# EAGLE design RPi SPI Display Breakout Board (EAGLE 9.6.1)
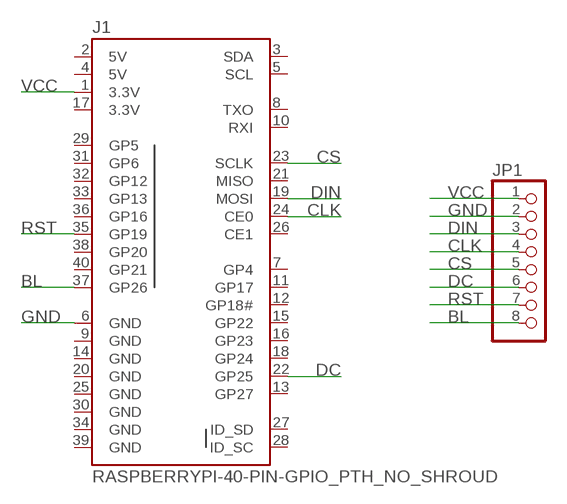
[diagram p0: schematic, sheet 1]

## Parts
J1  RASPBERRYPI-40-PIN-GPIO_PTH_NO_SHROUD  [2X20]
JP1  PINHD-1X8  [1X08]

## Nets
BL: J1.37(GP26) JP1.8
CLK: J1.24(CE0) JP1.4
CS: J1.23(SCLK) JP1.5
DC: J1.22(GP25) JP1.6
DIN: J1.19(MOSI) JP1.3
GND: J1.6(GND) JP1.2
RST: J1.35(GP19) JP1.7
VCC: J1.1(3.3V) JP1.1
Unconnected: J1.3(SDA) J1.5(SCL) J1.7(GP4) J1.8(TXO) J1.10(RXI) J1.11(GP17) J1.12(GP18#) J1.13(GP27) J1.15(GP22) J1.16(GP23) J1.18(GP24) J1.21(MISO) J1.26(CE1) J1.27(ID_SD) J1.28(ID_SC) J1.29(GP5) J1.31(GP6) J1.32(GP12) J1.33(GP13) J1.36(GP16) J1.38(GP20) J1.40(GP21)

## Power pins joined to a net without a drawn wire
3.3V: J1.17(3.3V)
5V: J1.2(5V) J1.4(5V)
GND: J1.9(GND) J1.14(GND) J1.20(GND) J1.25(GND) J1.30(GND) J1.34(GND) J1.39(GND)

## Library data of the parts
J1 = SparkFun-Connectors:RASPBERRYPI-40-PIN-GPIO: Raspberry Pi GPIO Header 2x20 pin connector, as found on B, B+, A+ models. Both shrouded PTH and SMT versions available. SparkFun Products: GPIO Shrouded Header <https://www.sparkfun.com/products/13054>- PTH SparkFun Pi Wedge (Preassembled) <https://www.sparkfun.com/products/13717>
JP1 = pinhead:PINHD-1X8: PIN HEADER

## Board
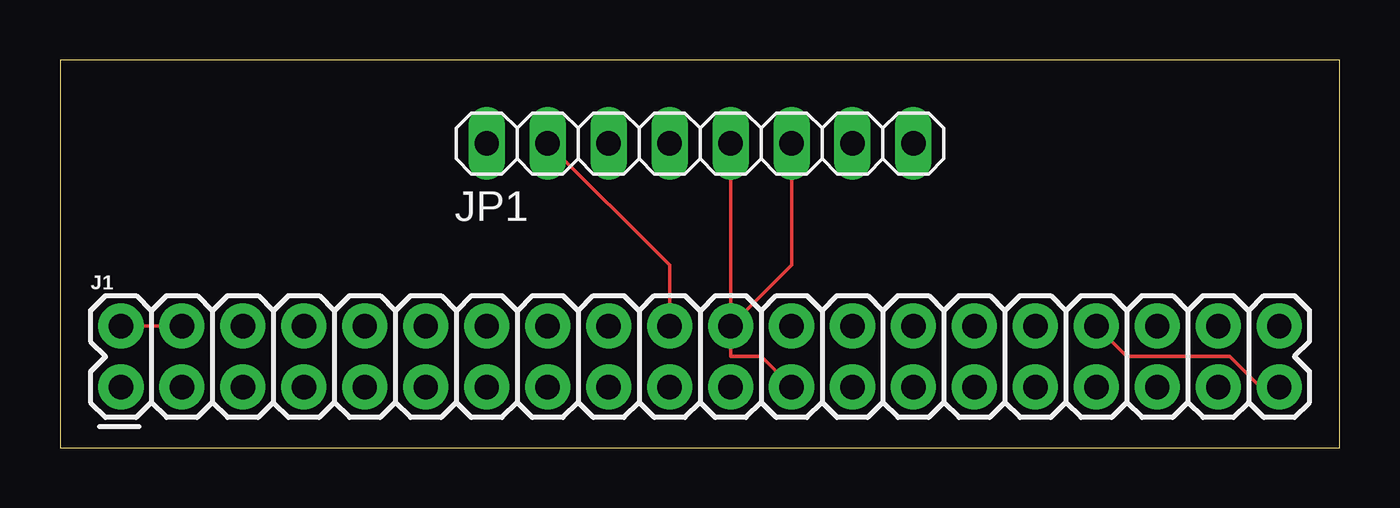
[diagram p1: board, top side]
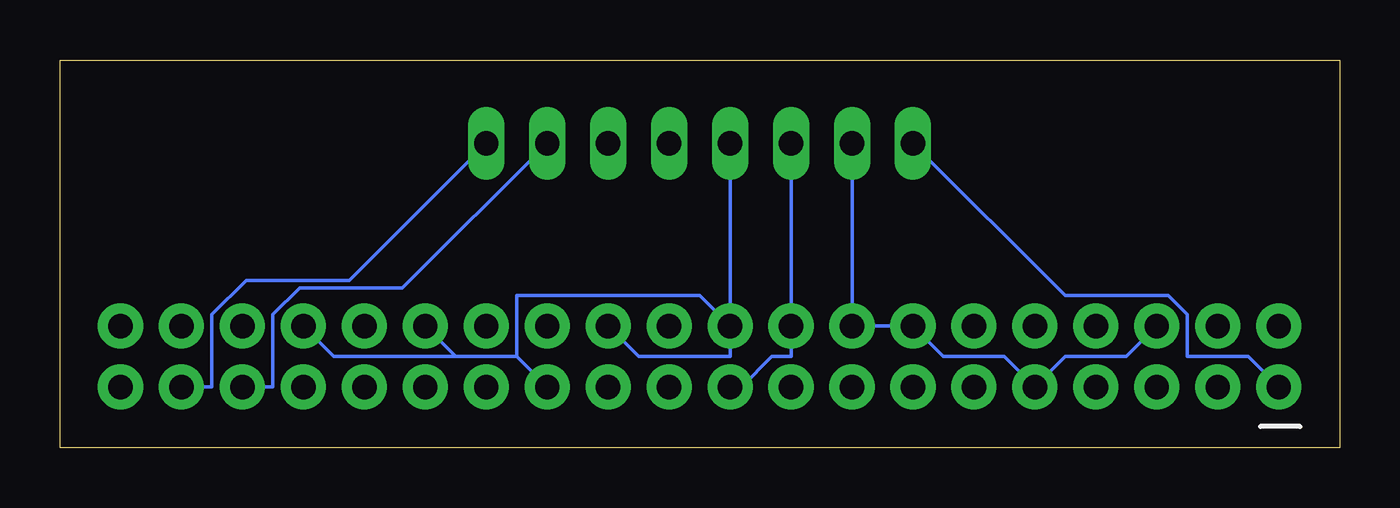
[diagram p2: board, bottom side, seen from below]

Size 53.32 x 16.18 mm. Coordinates in mm from the lower left corner, seen from the top.
Outline: 0,16.18 0,0 53.32,0 53.32,16.18 0,16.18
Copper layers (1*16): Top 0.035mm / dielectric 1.5mm / Bottom 0.035mm
Design rules "default": minimum track width 6mil, minimum drill 0.35mm, track to track 6mil, track to pad 6mil, pad to pad 6mil, via to via 6mil, smd to smd 6mil, copper to edge 40mil, drill to drill 6mil, minimum pad ring 10mil, minimum via ring 8mil, stop-mask expansion 4mil, vias tented up to drill 0mil, thermal gap 10mil

### Footprints (pad centres in the part's own frame; a part is rotated, then mirrored left to right if it is on the bottom)
2X20 = drill 1.016 pad 1.88: 1 0,0; 2 0,2.54; 3 2.54,0; 4 2.54,2.54; 5 5.08,0; 6 5.08,2.54; 7 7.62,0; 8 7.62,2.54; 9 10.16,0; 10 10.16,2.54; 11 12.7,0; 12 12.7,2.54; 13 15.24,0; 14 15.24,2.54; 15 17.78,0; 16 17.78,2.54; 17 20.32,0; 18 20.32,2.54; 19 22.86,0; 20 22.86,2.54; 21 25.4,0; 22 25.4,2.54; 23 27.94,0; 24 27.94,2.54; 25 30.48,0; 26 30.48,2.54; 27 33.02,0; 28 33.02,2.54; 29 35.56,0; 30 35.56,2.54; 31 38.1,0; 32 38.1,2.54; 33 40.64,0; 34 40.64,2.54; 35 43.18,0; 36 43.18,2.54; 37 45.72,0; 38 45.72,2.54; 39 48.26,0; 40 48.26,2.54
1X08 = drill 1.016 long: 1 -8.89,0; 2 -6.35,0; 3 -3.81,0; 4 -1.27,0; 5 1.27,0; 6 3.81,0; 7 6.35,0; 8 8.89,0

### Placement (x,y rotation side)
J1  2.54,2.54 0 top
JP1  26.67,12.7 0 top

### Tracks (layer width: path | path; a pad name or v marks a point on that pad's centre or on a via)
5V
  Top 0.152: J1.4 J1.2
BL
  Bottom 0.152: JP1.8 41.27,6.99 45.56,6.99 46.99,5.56 46.99,2.54 J1.37
CLK
  Bottom 0.152: JP1.4 25.4,3.81 29.21,3.81 J1.24
CS
  Top 0.152: JP1.5 27.94,3.81 29.21,3.81 J1.23
DC
  Top 0.152: JP1.6 30.48,7.62 J1.22
DIN
  Bottom 0.152: JP1.3 22.86,3.81 23.65,3.81 24.92,2.54 J1.19
GND
  Top 0.152: J1.39 50.01,2.54 48.74,3.81 44.45,3.81 J1.34 | J1.20 25.4,7.62 JP1.2
  Bottom 0.152: 34.29,3.81 J1.25 | 36.83,3.81 34.29,3.81 | J1.30 36.83,3.81 | J1.34 41.91,3.81 36.83,3.81 | J1.6 8.89,3.81 11.43,3.81 J1.9 13.97,3.81 16.51,3.81 J1.14 20.32,5.08 JP1.2 | 34.29,3.81 34.29,6.35 26.67,6.35 J1.20
RST
  Bottom 0.152: JP1.7 39.05,6.67 43.34,6.67 44.45,5.56 44.45,2.54 J1.35
VCC
  Bottom 0.152: JP1.1 11.43,6.35 7.14,6.35 6.35,5.56 6.35,3.81 3.81,3.81 J1.1